# Altium project Test_Bench_Back_Scatter_Reflection.PrjPcb
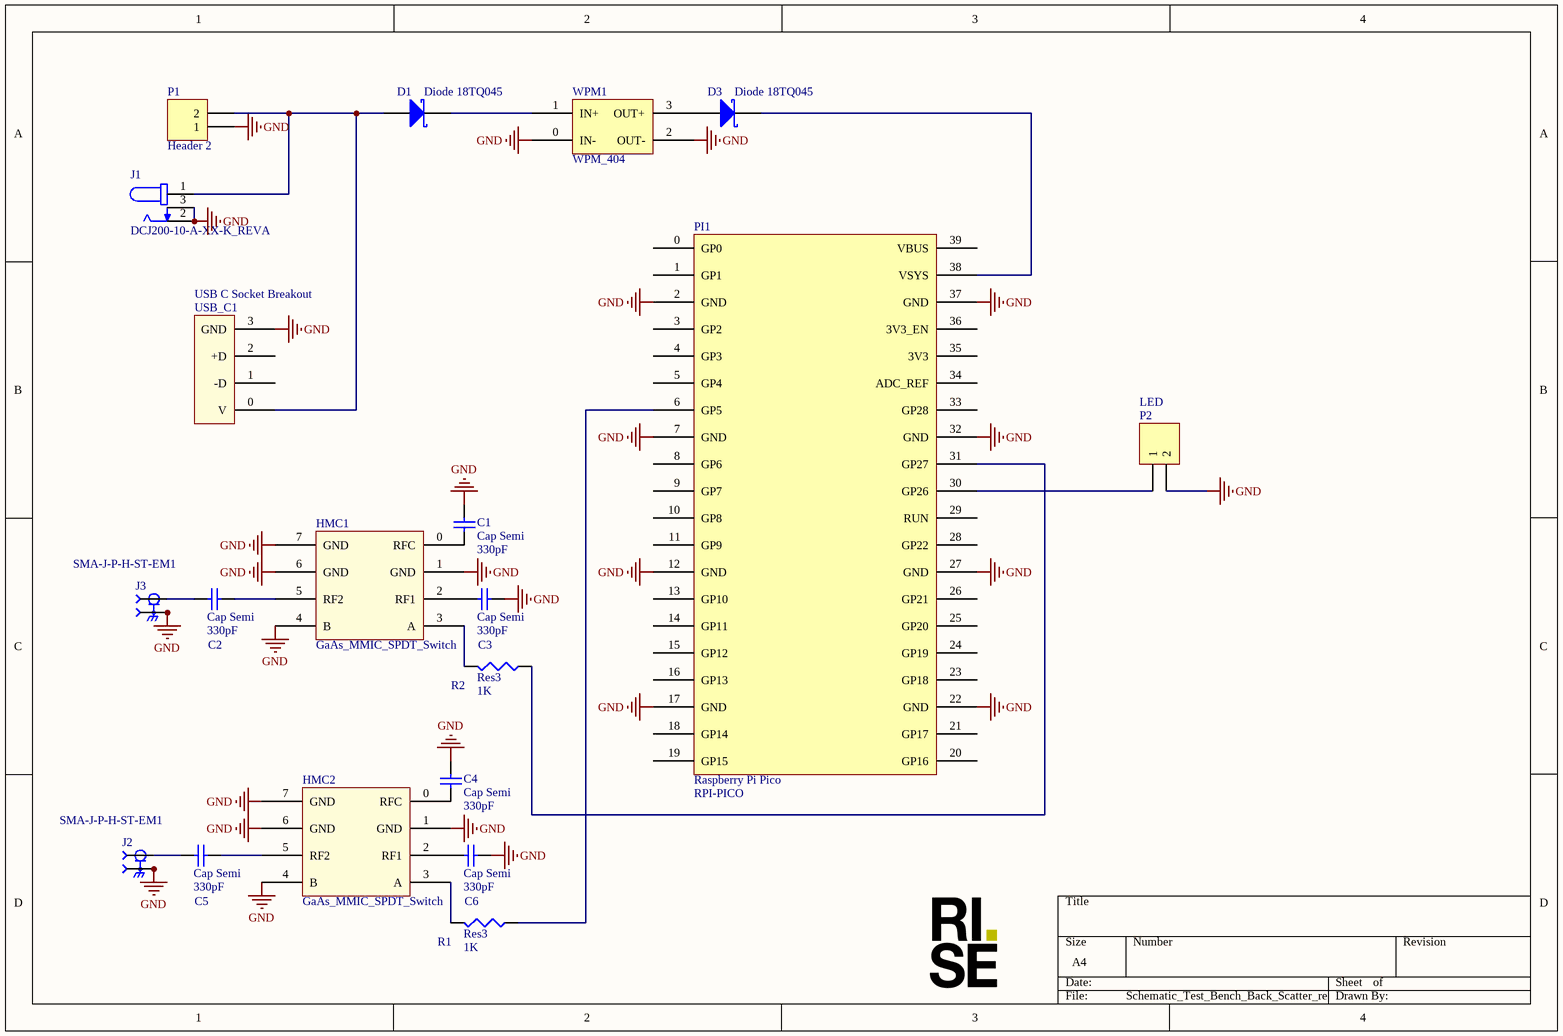
[diagram p0: Schematic_Test_Bench_Back_Scatter_reflection.SchDoc]
1 sheet, 21 parts. Net scope: global (net labels, ports and power ports of the same name join across sheets).
Board file: PCB_Test_Bench_Back_Scatter_Reflection.PcbDoc

## Sheet Schematic_Test_Bench_Back_Scatter_reflection.SchDoc
size A4

### Parts
*  RISE_LOGO  [RISE_Logo]  (value not drawn)
C1  Cap Semi  value 330pF  [C1206]
C2  Cap Semi  value 330pF  [C1206]
C3  Cap Semi  value 330pF  [C1206]
C4  Cap Semi  value 330pF  [C1206]
C5  Cap Semi  value 330pF  [C1206]
C6  Cap Semi  value 330pF  [C1206]
D1  Diode 18TQ045  [18TQ045-M3]
D3  Diode 18TQ045  [18TQ045-M3]
HMC1  GaAs_MMIC_SPDT_Switch  [HMC190BMS8E]
HMC2  GaAs_MMIC_SPDT_Switch  [HMC190BMS8E]
J1  DCJ200-10-A-XX-K_REVA  [GCT_DCJ200-10-A-XX-K_REVA]
J2  SMA-J-P-H-ST-EM1  [SAMTEC_SMA-J-P-H-ST-EM1]
J3  SMA-J-P-H-ST-EM1  [SAMTEC_SMA-J-P-H-ST-EM1]
P1  Header 2  [HDR1X2]
P2  LED  [HDR1X2]
PI1  Raspberry Pi Pico  Supplier Part Number 1: RPI-PICO  [Raspberry Pi Pico]
R1  Res3  value 1K  [J1-0603]
R2  Res3  value 1K  [J1-0603]
USB_C1  USB C Socket Breakout  [Simple_USB_C_Socket_Breakout]
WPM1  WPM_404  [WPM404_SMD]

### Nets
GND: C1.2 C3.2 C4.2 C6.2 HMC1.1(GND) HMC1.4(B) HMC1.6(GND) HMC1.7(GND) HMC2.1(GND) HMC2.4(B) HMC2.6(GND) HMC2.7(GND) J1.2 J1.3 J2.2_1 J2.2_2 J2.3_1 J2.3_2 J3.2_1 J3.2_2 J3.3_1 J3.3_2 P1.1 P2.2 PI1.2(GND) PI1.7(GND) PI1.12(GND) PI1.17(GND) PI1.22(GND) PI1.27(GND) PI1.32(GND) PI1.37(GND) USB_C1.3(GND) WPM1.0(IN-) WPM1.2(OUT-)
NetC1_1: C1.1 HMC1.0(RFC)
NetC2_1: C2.1 J3.1
NetC2_2: C2.2 HMC1.5(RF2)
NetC3_1: C3.1 HMC1.2(RF1)
NetC4_1: C4.1 HMC2.0(RFC)
NetC5_1: C5.1 J2.1
NetC5_2: C5.2 HMC2.5(RF2)
NetC6_1: C6.1 HMC2.2(RF1)
NetD1_1: D1.1(K) WPM1.1(IN+)
NetD1_3: D1.3(A) J1.1 P1.2 USB_C1.0(V)
NetD3_1: D3.1(K) PI1.38(VSYS)
NetD3_3: D3.3(A) WPM1.3(OUT+)
NetHMC1_3: HMC1.3(A) R2.2
NetHMC2_3: HMC2.3(A) R1.2
NetP2_1: P2.1 PI1.30(GP26)
NetPI1_6: PI1.6(GP5) R1.1
NetPI1_31: PI1.31(GP27) R2.1

Not connected (* = marked no-connect by the designer): PI1 0(GP0) 1(GP1) 3(GP2) 4(GP3) 5(GP4) 8(GP6) 9(GP7) 10(GP8) 11(GP9) 13(GP10) 14(GP11) 15(GP12) 16(GP13) 18(GP14) 19(GP15) 20(GP16) 21(GP17) 23(GP18) 24(GP19) 25(GP20) 26(GP21) 28(GP22) 29(RUN) 33(GP28) 34(ADC_REF) 35(3V3) 36(3V3_EN) 39(VBUS); USB_C1 1(-D) 2(+D)

### Library data of the parts
C1-C6 = Cap Semi: Capacitor (Semiconductor SIM Model); Published: 8-Jun-2000; LatestRevisionDate: 29-May-2009; LatestRevisionNote: IPC-7351 Footprint Added.; PackageReference: C1206; Publisher: Altium Limited; PackageDescription: Chip Capacitor
D1 D3 = Diode 18TQ045: Schottky Rectifier; Note: Terminal 2 is the TAB and is electrically connected to the cathode; Published: 8-Jun-2000; LatestRevisionDate: 17-Jul-2002; LatestRevisionNote: Re-released for DXP Platform.; DatasheetVersion: Dec-1997; PackageVersion: Feb-1998; PackageReference: TO-220AC; Publisher: Altium Limited; PackageDescription: TO, Thru-Hole, Vertical, Heatsink Mounted; 3 In-Line Leads (1 Absent); Pitch 2.54 mm; ComponentLink1Description: Manufacturer Link; ComponentLink1URL: http://www.irf.com/; ComponentLink2Description: Datasheet; ComponentLink2URL: http://www.irf.com/product-info/datasheets/data/18tq.pdf
HMC1 HMC2 = HMC190BMS8E
J1 = DCJ200-10-A-XX-K_REVA: Power Barrel Connector Jack 2.05mm ID (0.081), 5.50mm OD (0.217) Through Hole, Right Angle; MF: Global Connector Technology; MP: DCJ200-10-A-K1-K; SnapEDA_Link: https://www.snapeda.com/parts/DCJ200-10-A-K1-K/Global+Connector+Technology/view-part/?ref=snap; Package: None; Value: *; Check_prices: https://www.snapeda.com/parts/DCJ200-10-A-K1-K/Global+Connector+Technology/view-part/?ref=eda
J2 J3 = SMA-J-P-H-ST-EM1: SMA Connector Jack, Female Socket 50Ohm Board Edge, End Launch Solder; MF: Samtec; Package: None; Price: None; Value: *; MP: SMA-J-P-H-ST-EM1; Availability: Unavailable
P1 P2 = Header 2: Header, 2-Pin; LatestRevisionDate: 17-Jul-2002; LatestRevisionNote: Re-released for DXP Platform.; Publisher: Altium Limited
PI1 = Raspberry_Pi_Pico_Header: Supplier 1: TME
R1 R2 = Res3: Resistor; Published: 8-Jun-2000; LatestRevisionDate: 29-May-2009; LatestRevisionNote: IPC-7351 Footprint Added.; PackageReference: J1-0603; Publisher: Altium Limited; PackageDescription: Chip Resistor
USB_C1 = USB C Socket Breakout: Simple USB C Socket Breakout
WPM1 = WPM_404: Velleman WPM404 Whadda DC-DC Adjustable Voltage Step-Down Module LM2596S